# Altium schematic sheet PART3.SchDoc
size 558 x 431 mm
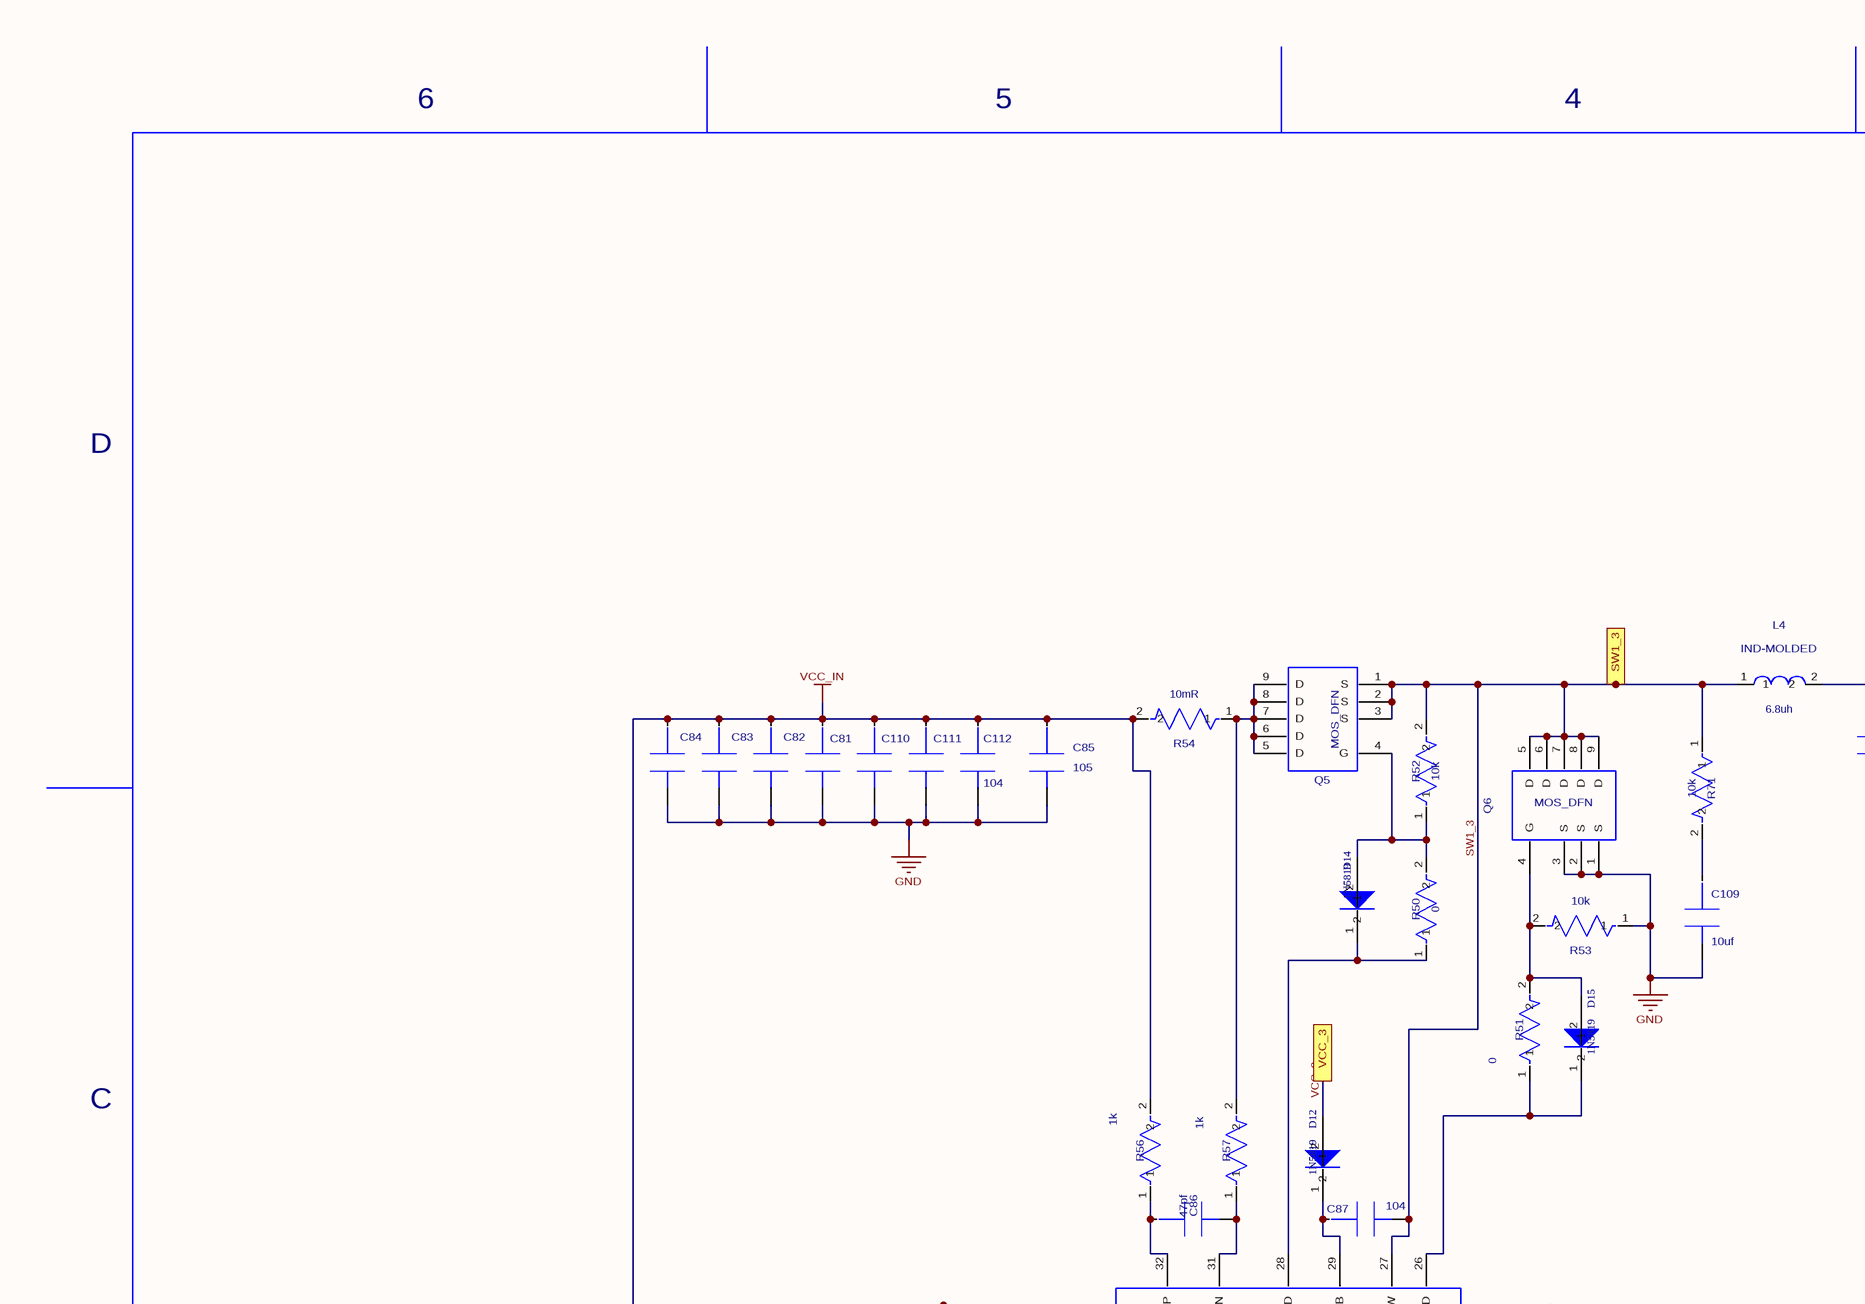
[diagram p0: PART3.SchDoc, top left]
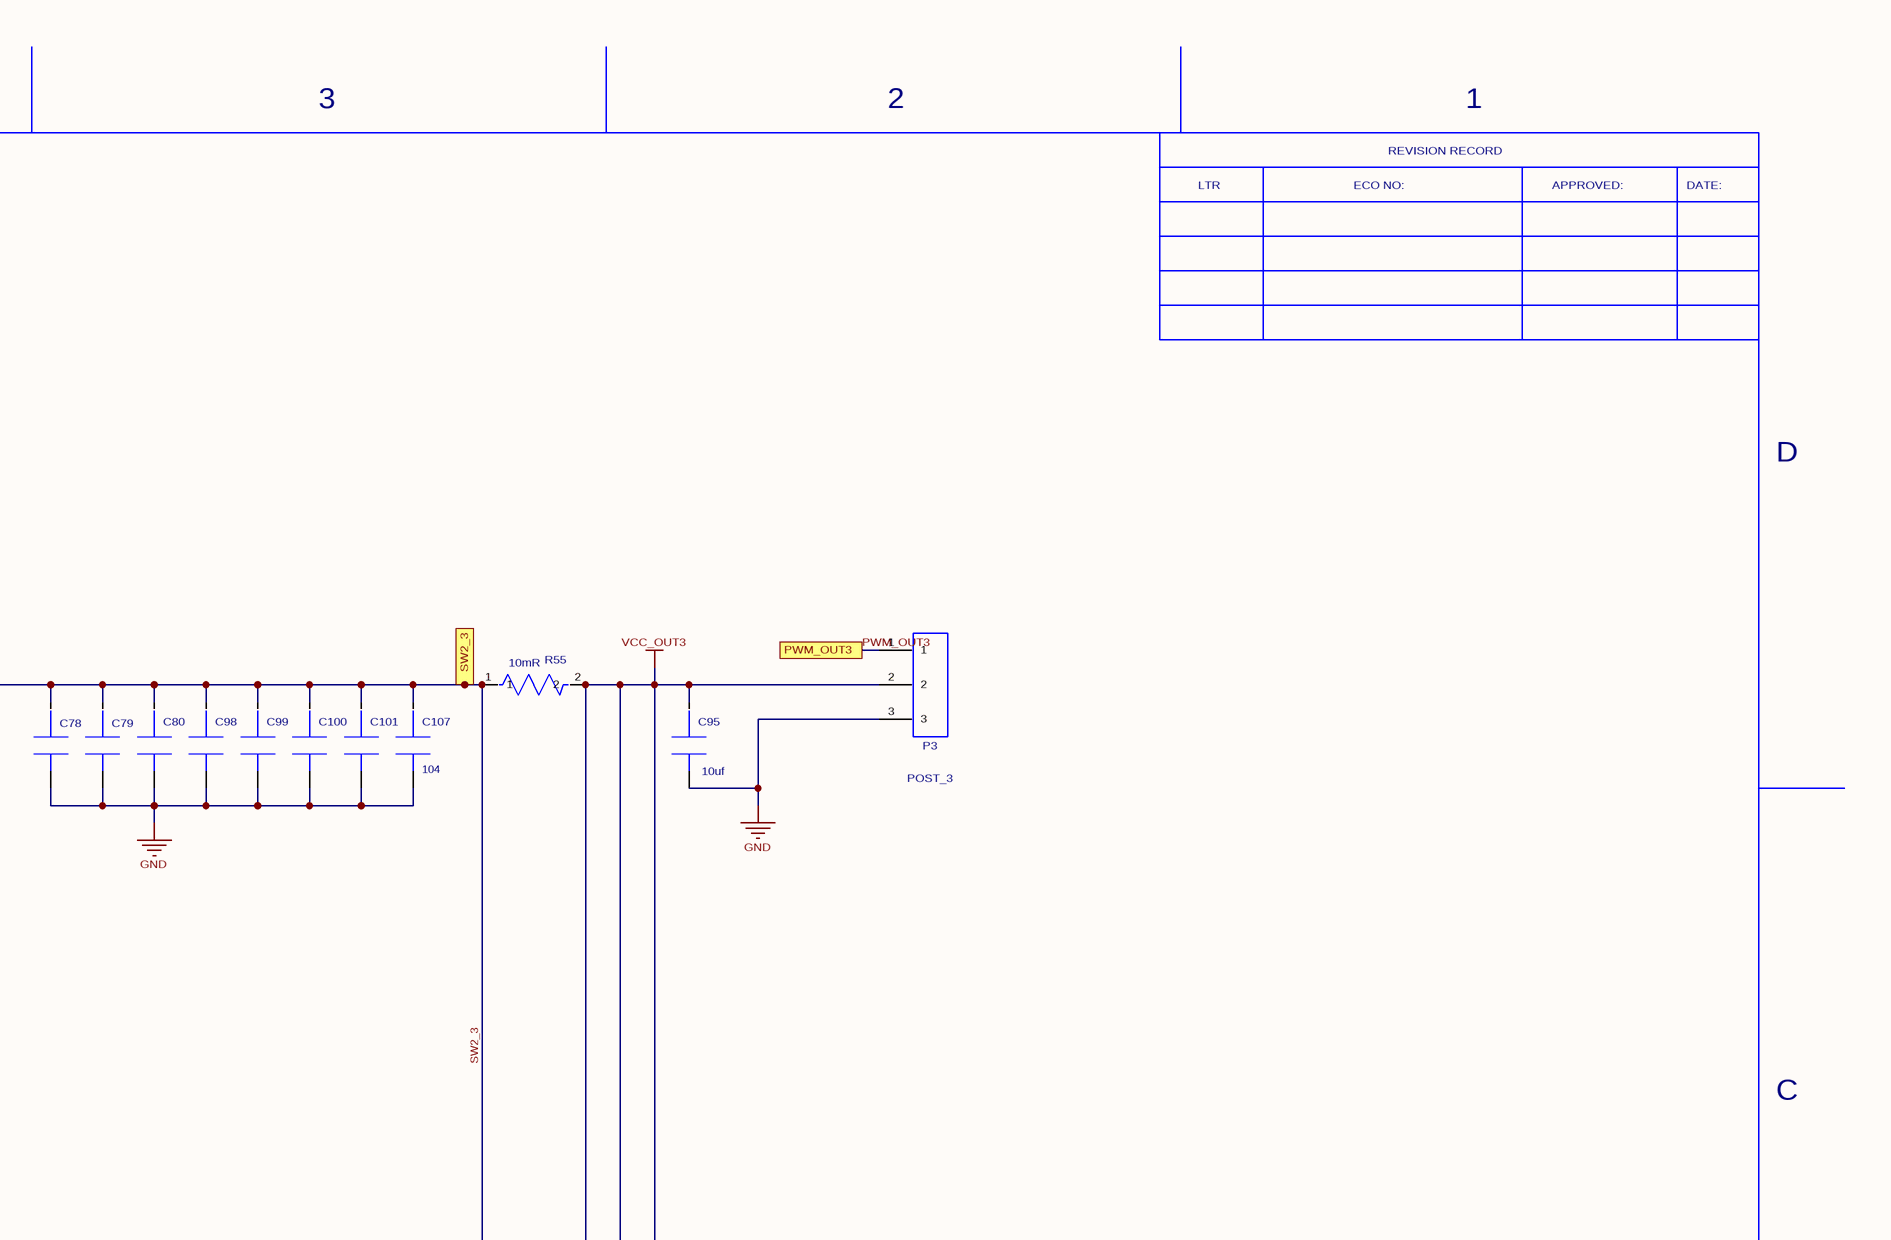
[diagram p1: PART3.SchDoc, top right]
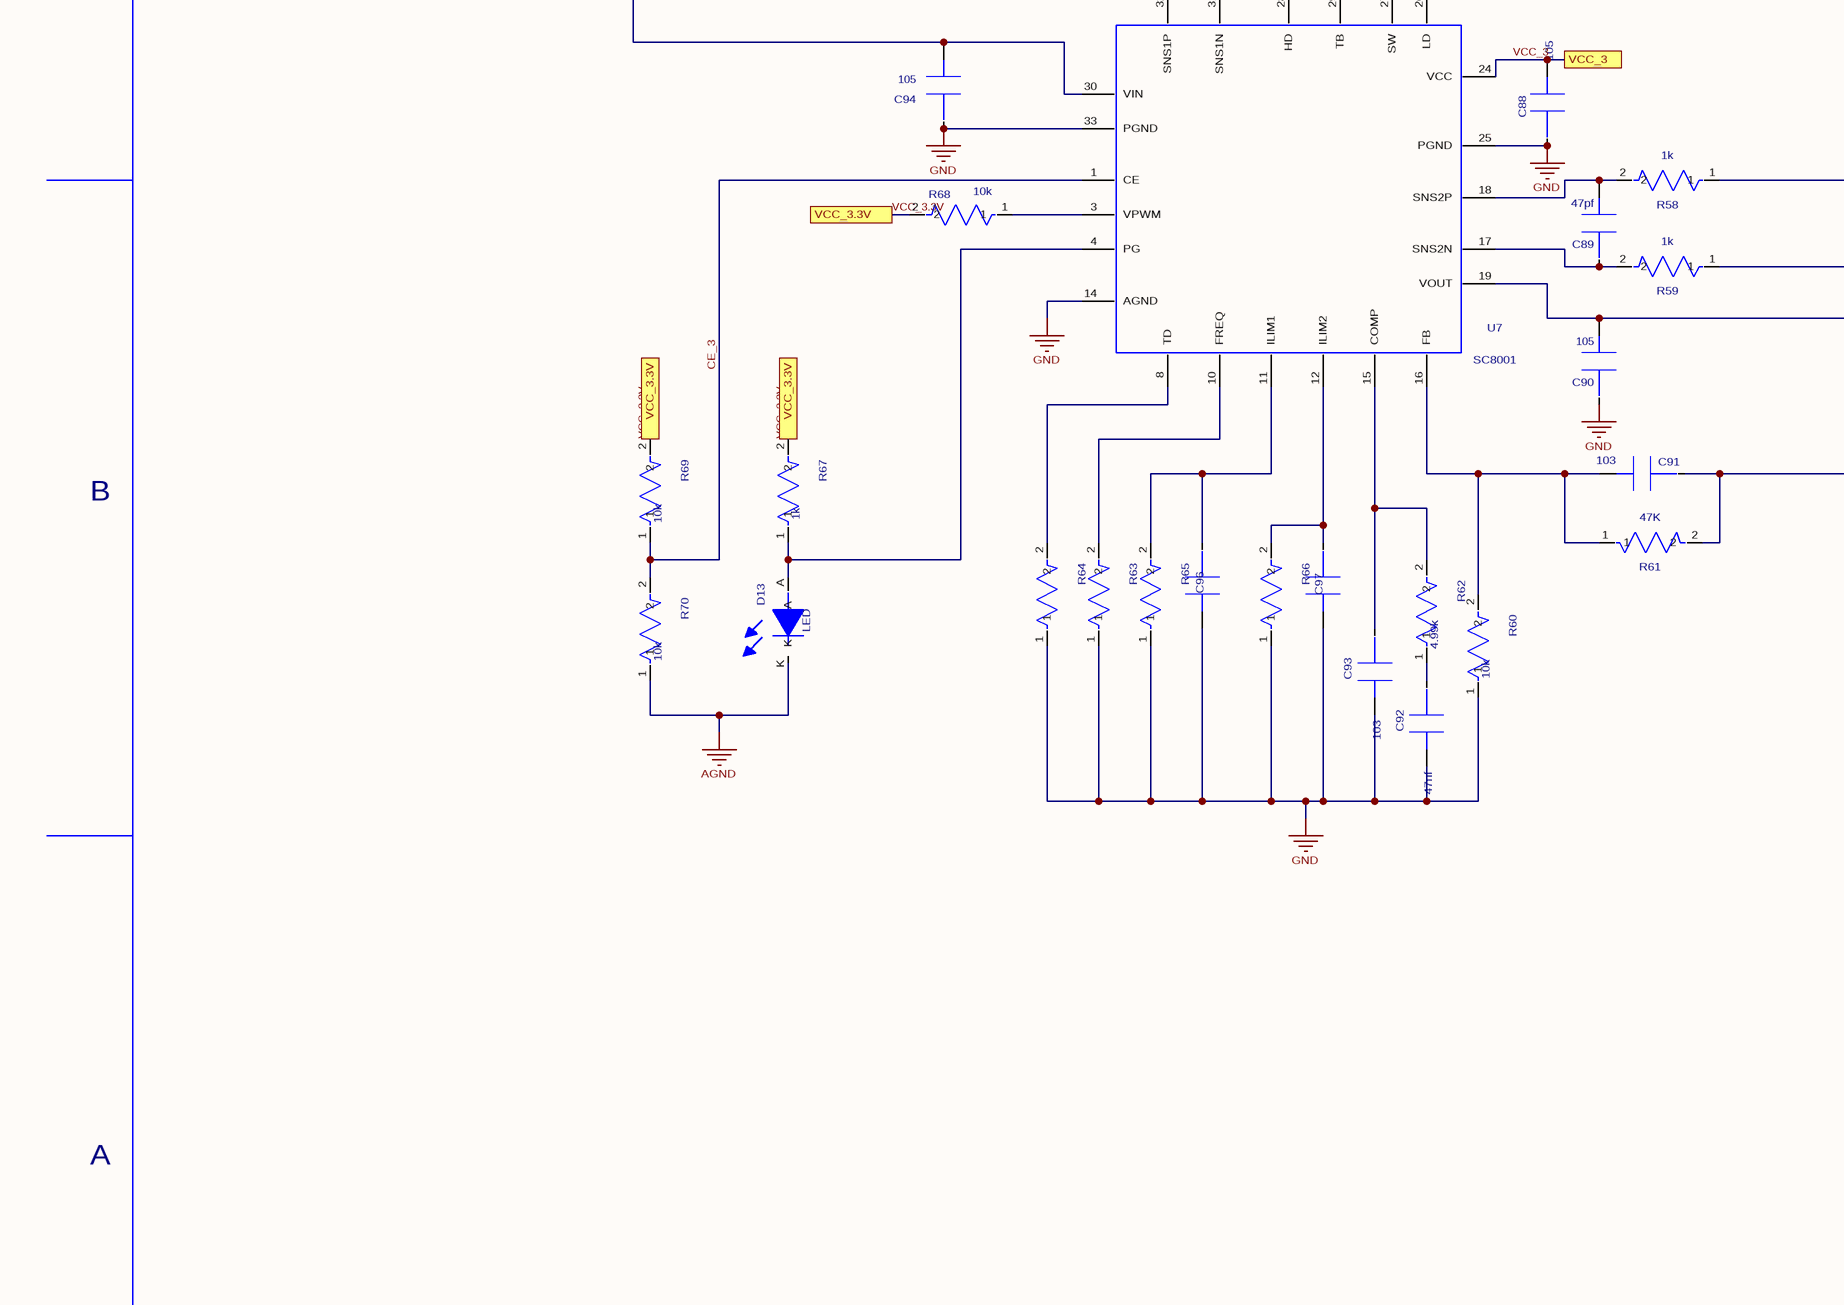
[diagram p2: PART3.SchDoc, bottom left]
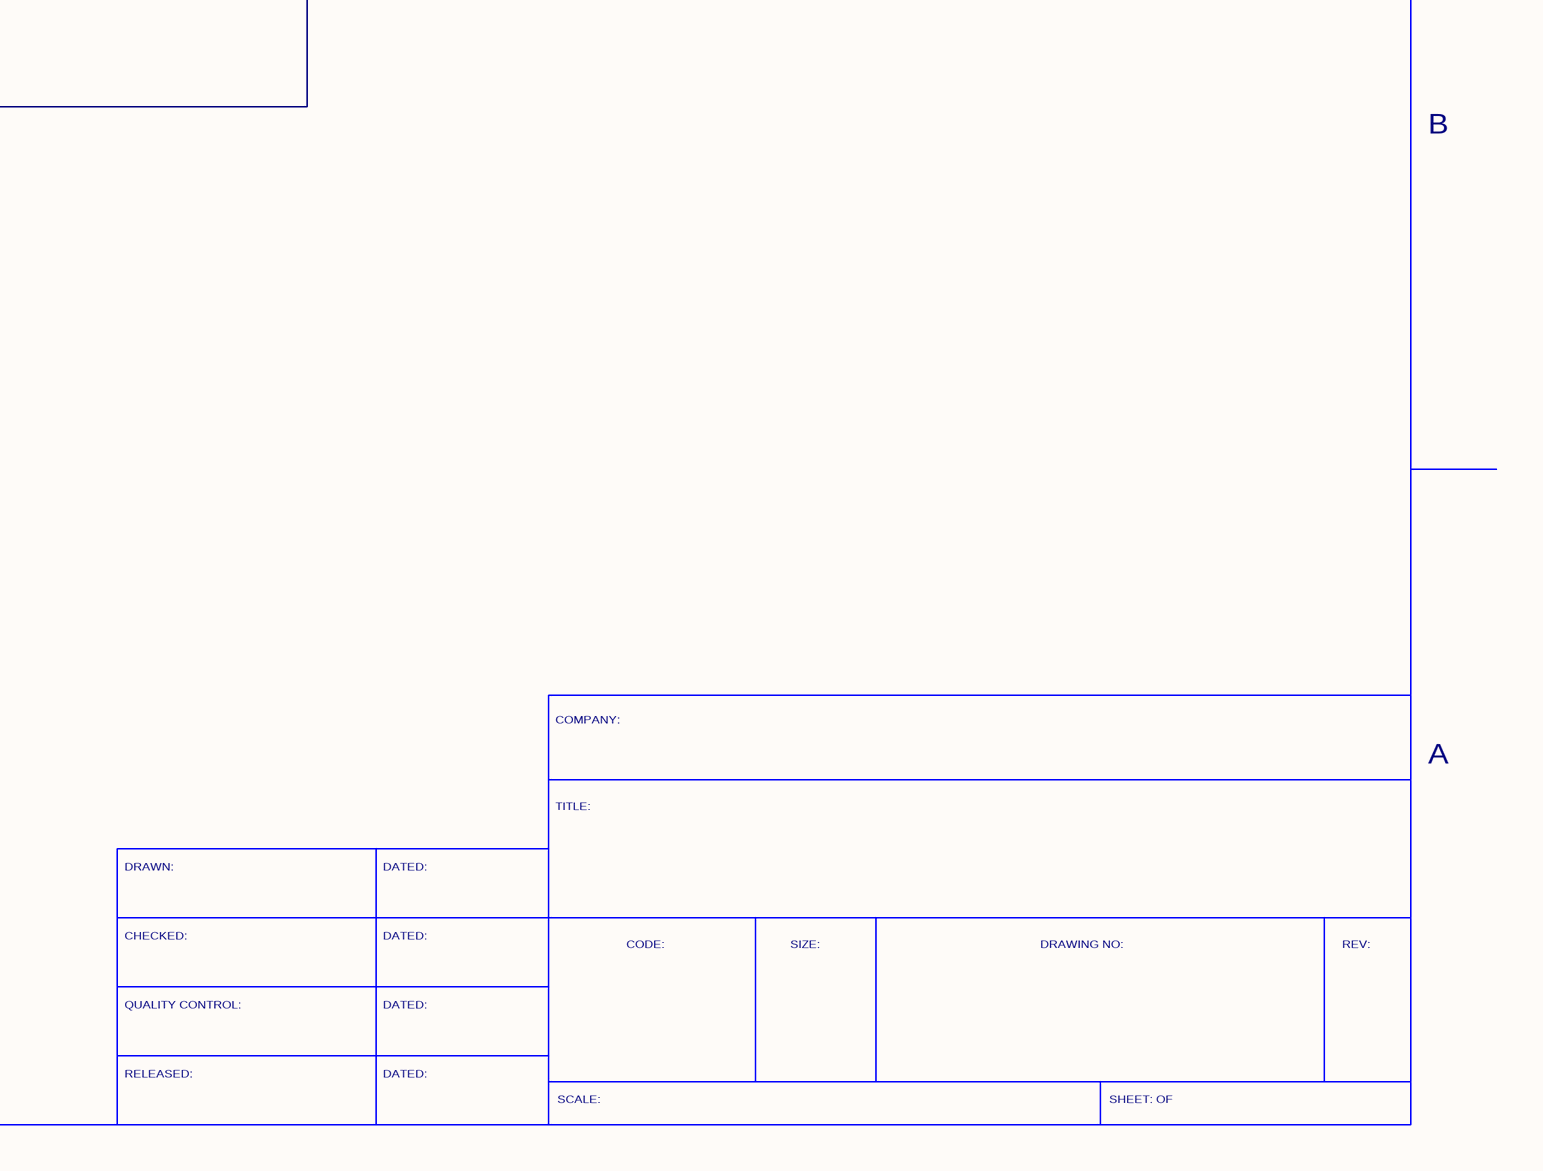
[diagram p3: PART3.SchDoc, bottom right]

## Parts
C78  CAP-AE6.3  [CC6.56.5]  (value not drawn)
C79  CAP-AE6.3  [CC6.56.5]  (value not drawn)
C80  CAP-CFR04R-C  [1206C]  (value not drawn)
C81  CAP-CFR04R-C  [1210C]  (value not drawn)
C82  CAP-CFR04R-C  [1210C]  (value not drawn)
C83  CAP-CFR04R-C  [1206C]  (value not drawn)
C84  CAP-CFR04R-C  [1210C]  (value not drawn)
C85  value 105  [0805C]  (hidden comment: CAP-CFR04R-C)
C86  value 47pf  [0603C]  (hidden comment: CAP-CFR04R-C)
C87  value 104  [0805C]  (hidden comment: CAP-CFR04R-C)
C88  value 105  [0805C]  (hidden comment: CAP-CFR04R-C)
C89  value 47pf  [0603C]  (hidden comment: CAP-CFR04R-C)
C90  value 105  [0805C]  (hidden comment: CAP-CFR04R-C)
C91  value 103  [0603C]  (hidden comment: CAP-CFR04R-C)
C92  value 47nf  [0603C]  (hidden comment: CAP-CFR04R-C)
C93  value 103  [0603C]  (hidden comment: CAP-CFR04R-C)
C94  value 105  [0805C]  (hidden comment: CAP-CFR04R-C)
C95  value 10uf  [1206C]  (hidden comment: CAP-CFR04R-C)
C96  CAP-CFR04R-C  [0603C]  (value not drawn)
C97  CAP-CFR04R-C  [0603C]  (value not drawn)
C98  CAP-CFR04R-C  [1206C]  (value not drawn)
C99  CAP-CFR04R-C  [1206C]  (value not drawn)
C100  CAP-CFR04R-C  [1206C]  (value not drawn)
C101  CAP-CFR04R-C  [1206C]  (value not drawn)
C107  value 104  [1206C]  (hidden comment: CAP-CFR04R-C)
C109  value 10uf  [0805C]  (hidden comment: CAP-CFR04R-C)
C110  CAP-CFR04R-C  [1210C]  (value not drawn)
C111  CAP-CFR04R-C  [1210C]  (value not drawn)
C112  value 104  [0805C]  (hidden comment: CAP-CFR04R-C)
D12  1N5819  [SOD-123_L2.8-W1.8-LS3.7-RD]
D13  LED  [0805D]
D14  1N5819  [SOD-123_L2.8-W1.8-LS3.7-RD]
D15  1N5819  [SOD-123_L2.8-W1.8-LS3.7-RD]
L4  IND-MOLDED  value 6.8uh  [1040L]
P3  POST_3  [POST_3]
Q5  MOS_DFN  [DFN-8_5X6]
Q6  MOS_DFN  [DFN-8_5X6]
R50  value 0  [0603R]  (hidden comment: RES-WR1)
R51  value 0  [0603R]  (hidden comment: RES-WR1)
R52  value 10k  [0603R]  (hidden comment: RES-WR1)
R53  value 10k  [0603R]  (hidden comment: RES-WR1)
R54  value 10mR  [1206C]  (hidden comment: RES-WR1)
R55  value 10mR  [1206C]  (hidden comment: RES-WR1)
R56  value 1k  [0603R]  (hidden comment: RES-WR1)
R57  value 1k  [0603R]  (hidden comment: RES-WR1)
R58  value 1k  [0603R]  (hidden comment: RES-WR1)
R59  value 1k  [0603R]  (hidden comment: RES-WR1)
R60  value 10k  [0603R]  (hidden comment: RES-WR1)
R61  value 47K  [0603R]  (hidden comment: RES-WR1)
R62  value 4.99k  [0603R]  (hidden comment: RES-WR1)
R63  RES-WR1  [0603R]  (value not drawn)
R64  RES-WR1  [0603R]  (value not drawn)
R65  RES-WR1  [0603R]  (value not drawn)
R66  RES-WR1  [0603R]  (value not drawn)
R67  value 1k  [0805R]  (hidden comment: RES-WR1)
R68  value 10k  [0805R]  (hidden comment: RES-WR1)
R69  value 10k  [0805R]  (hidden comment: RES-WR1)
R70  value 10k  [0805R]  (hidden comment: RES-WR1)
R71  value 10k  [1206C]  (hidden comment: RES-WR1)
U7  SC8001  [QFN-32_L4.0-W4.0-P0.40-BL-EP2.7]

## Ports
PWM_OUT3, SW1_3, SW2_3, VCC_3, VCC_3.3V

## Nets
AGND: D13.K R70.1
GND: C78.2 C79.2 C80.2 C81.2 C82.2 C83.2 C84.2 C85.2 C88.1 C90.1 C92.2 C93.2 C94.1 C95.2 C96.2 C97.2 C98.2 C99.2 C100.2 C101.2 C107.2 C109.2 C110.2 C111.2 C112.2 P3.3 Q6.1(S) Q6.2(S) Q6.3(S) R53.1 R60.1 R63.1 R64.1 R65.1 R66.1 U7.14(AGND) U7.25(PGND) U7.33(PGND)
VCC_IN: C81.1 C82.1 C83.1 C84.1 C85.1 C94.2 C110.1 C111.1 C112.1 R54.2 R56.2 U7.30(VIN)
VCC_OUT3: C90.2 C91.1 C95.1 P3.2 R55.2 R59.1 R61.2 U7.19(VOUT)
CE_3: R69.1 R70.2 U7.1(CE)
PWM_OUT3: P3.1 ; port PWM_OUT3
SW1_3: C87.2 L4.1 Q5.1(S) Q5.2(S) Q5.3(S) Q6.5(D) Q6.6(D) Q6.7(D) Q6.8(D) Q6.9(D) R52.2 R71.1 U7.27(SW) ; port SW1_3
SW2_3: C78.1 C79.1 C80.1 C98.1 C99.1 C100.1 C101.1 C107.1 L4.2 R55.1 R58.1 ; port SW2_3
VCC_3: C88.2 D12.2 U7.24(VCC) ; port VCC_3
VCC_3.3V: R67.2 R68.2 R69.2 ; port VCC_3.3V
NetC86_1: C86.1 R56.1 U7.32(SNS1P)
NetC86_2: C86.2 R57.1 U7.31(SNS1N)
NetC87_1: C87.1 D12.1 U7.29(TB)
NetC89_1: C89.1 R59.2 U7.17(SNS2N)
NetC89_2: C89.2 R58.2 U7.18(SNS2P)
NetC91_2: C91.2 R60.2 R61.1 U7.16(FB)
NetC92_1: C92.1 R62.1
NetC93_1: C93.1 R62.2 U7.15(COMP)
NetC96_1: C96.1 R65.2 U7.11(ILIM1)
NetC97_1: C97.1 R66.2 U7.12(ILIM2)
NetC109_1: C109.1 R71.2
NetD13_A: D13.A R67.1 U7.4(PG)
NetD14_1: D14.1 R50.1 U7.28(HD)
NetD14_2: D14.2 Q5.4(G) R50.2 R52.1
NetD15_1: D15.1 R51.1 U7.26(LD)
NetD15_2: D15.2 Q6.4(G) R51.2 R53.2
NetQ5_5: Q5.5(D) Q5.6(D) Q5.7(D) Q5.8(D) Q5.9(D) R54.1 R57.2
NetR63_2: R63.2 U7.10(FREQ)
NetR64_2: R64.2 U7.8(TD)
NetR68_1: R68.1 U7.3(VPWM)

## Notes on the sheet
- 6
- 5
- 4
- 3
- 2
- 1
- LTR
- ECO NO:
- REVISION RECORD
- APPROVED:
- DATE:
- D
- C
- B
- COMPANY:
- A
- TITLE:
- DRAWN:
- DATED:
- CHECKED:
- CODE:
- SIZE:
- DRAWING NO:
- REV:
- QUALITY CONTROL:
- RELEASED:
- SCALE:
- SHEET: OF

## Library data of the parts
C78 C79 = CAP-AE6.3: ALUMINUM ELECTROLYTIC CAP.; Manufacturer #1: IPC SM-782 STD.; Sim.Analog.Order: Model$; Sim.Analog.Prefix: C; Value: ???; PCB DECAL: CC6.56.5
C80-C84 C98-C101 C110 C111 = CAP-CFR04R-C: RADIAL FILM CAPACITOR, MIL-SPEC SIZE CFR04R SIZE 'C'; Manufacturer #1: KEMET; Part Number: TBD; Voltage Rating: ???; Value: 10uf; Sim.Analog.Prefix: C; Sim.Analog.Order: Model$; Tolerance: ???
  C80 C83 C98-C101: PCB DECAL: 1206C
  C81 C82 C84 C110 C111: PCB DECAL: 1210C
C85-C95 C107 C109 C112 = CAP-CFR04R-C: RADIAL FILM CAPACITOR, MIL-SPEC SIZE CFR04R SIZE 'C'; Manufacturer #1: KEMET; Part Number: TBD; Voltage Rating: ???; Sim.Analog.Prefix: C; Sim.Analog.Order: Model$; Tolerance: ???
  C85 C87 C88 C90 C94 C109 C112: PCB DECAL: 0805C
  C86 C89 C91-C93: PCB DECAL: 0603C
  C95 C107: PCB DECAL: 1206C
C96 C97 = CAP-CFR04R-C: RADIAL FILM CAPACITOR, MIL-SPEC SIZE CFR04R SIZE 'C'; Manufacturer #1: KEMET; Part Number: TBD; Voltage Rating: ???; Value: 103; Sim.Analog.Prefix: C; Sim.Analog.Order: Model$; Tolerance: ???; PCB DECAL: 0603C
D12 D14 D15 = DIODE_1N4148: High Conductance Fast Diode; ComponentLink2URL: http://www.fairchildsemi.com/ds/1N%2F1N4148.pdf; ComponentLink2Description: Datasheet; ComponentLink1URL: http://www.fairchildsemi.com/; ComponentLink1Description: Manufacturer Link; Code_JEDEC: DO-204-AH; PackageDescription: Diode, Axial; Body 3.8 x 1.9 mm (LxDia. max), Lead Dia. 0.53 mm (max); Publisher: Altium Limited; PackageReference: DO-35; DatasheetVersion: 1997; LatestRevisionNote: Re-released for DXP Platform.; LatestRevisionDate: 17-Jul-2002; Published: 8-Jun-2000; PCB DECAL: SOD-123_L2.8-W1.8-LS3.7-RD; Comment_1: DIODE_1N4148
D13 = LED: LIGHT EMITTING DIODE; Sim.Analog.Order: Model$; Sim.Analog.Prefix: D; Color: ???; PCB DECAL: 0805D
L4 = IND-MOLDED: MOLDED INDUCTOR, 0.5" PIN SPACING; Sim.Analog.Order: Model$; Sim.Analog.Prefix: L; PCB DECAL: 1040L
R50-R62 R67-R71 = RES-WR1: WIRE WOUND RESISTOR 3.4 X 7.05 MM; Manufacturer #1: IPC SM-782 STD.; Sim.Analog.Order: Model$; Sim.Analog.Prefix: R
  R50-R53 R56-R62: PCB DECAL: 0603R
  R54 R55 R71: PCB DECAL: 1206C
  R67-R70: PCB DECAL: 0805R
R63 = RES-WR1: WIRE WOUND RESISTOR 3.4 X 7.05 MM; Manufacturer #1: IPC SM-782 STD.; Sim.Analog.Order: Model$; Sim.Analog.Prefix: R; Value: 0R; PCB DECAL: 0603R
R64 = RES-WR1: WIRE WOUND RESISTOR 3.4 X 7.05 MM; Manufacturer #1: IPC SM-782 STD.; Sim.Analog.Order: Model$; Sim.Analog.Prefix: R; Value: 68k; PCB DECAL: 0603R
R65 R66 = RES-WR1: WIRE WOUND RESISTOR 3.4 X 7.05 MM; Manufacturer #1: IPC SM-782 STD.; Sim.Analog.Order: Model$; Sim.Analog.Prefix: R; Value: 10k; PCB DECAL: 0603R
P3 = POST_3: PCB DECAL: POST_3
Q5 Q6 = MOS_DFN: PCB DECAL: DFN-8_5X6
U7 = SC8001: PCB DECAL: QFN-32_L4.0-W4.0-P0.40-BL-EP2.7